# EasyEDA schematic Attiny_sender.json
TITLE: Sheet_1; REV: 1.0; Date: 2026-06-16; Sheet: 1/1; Drawn By: ondori38; Company: Your Company
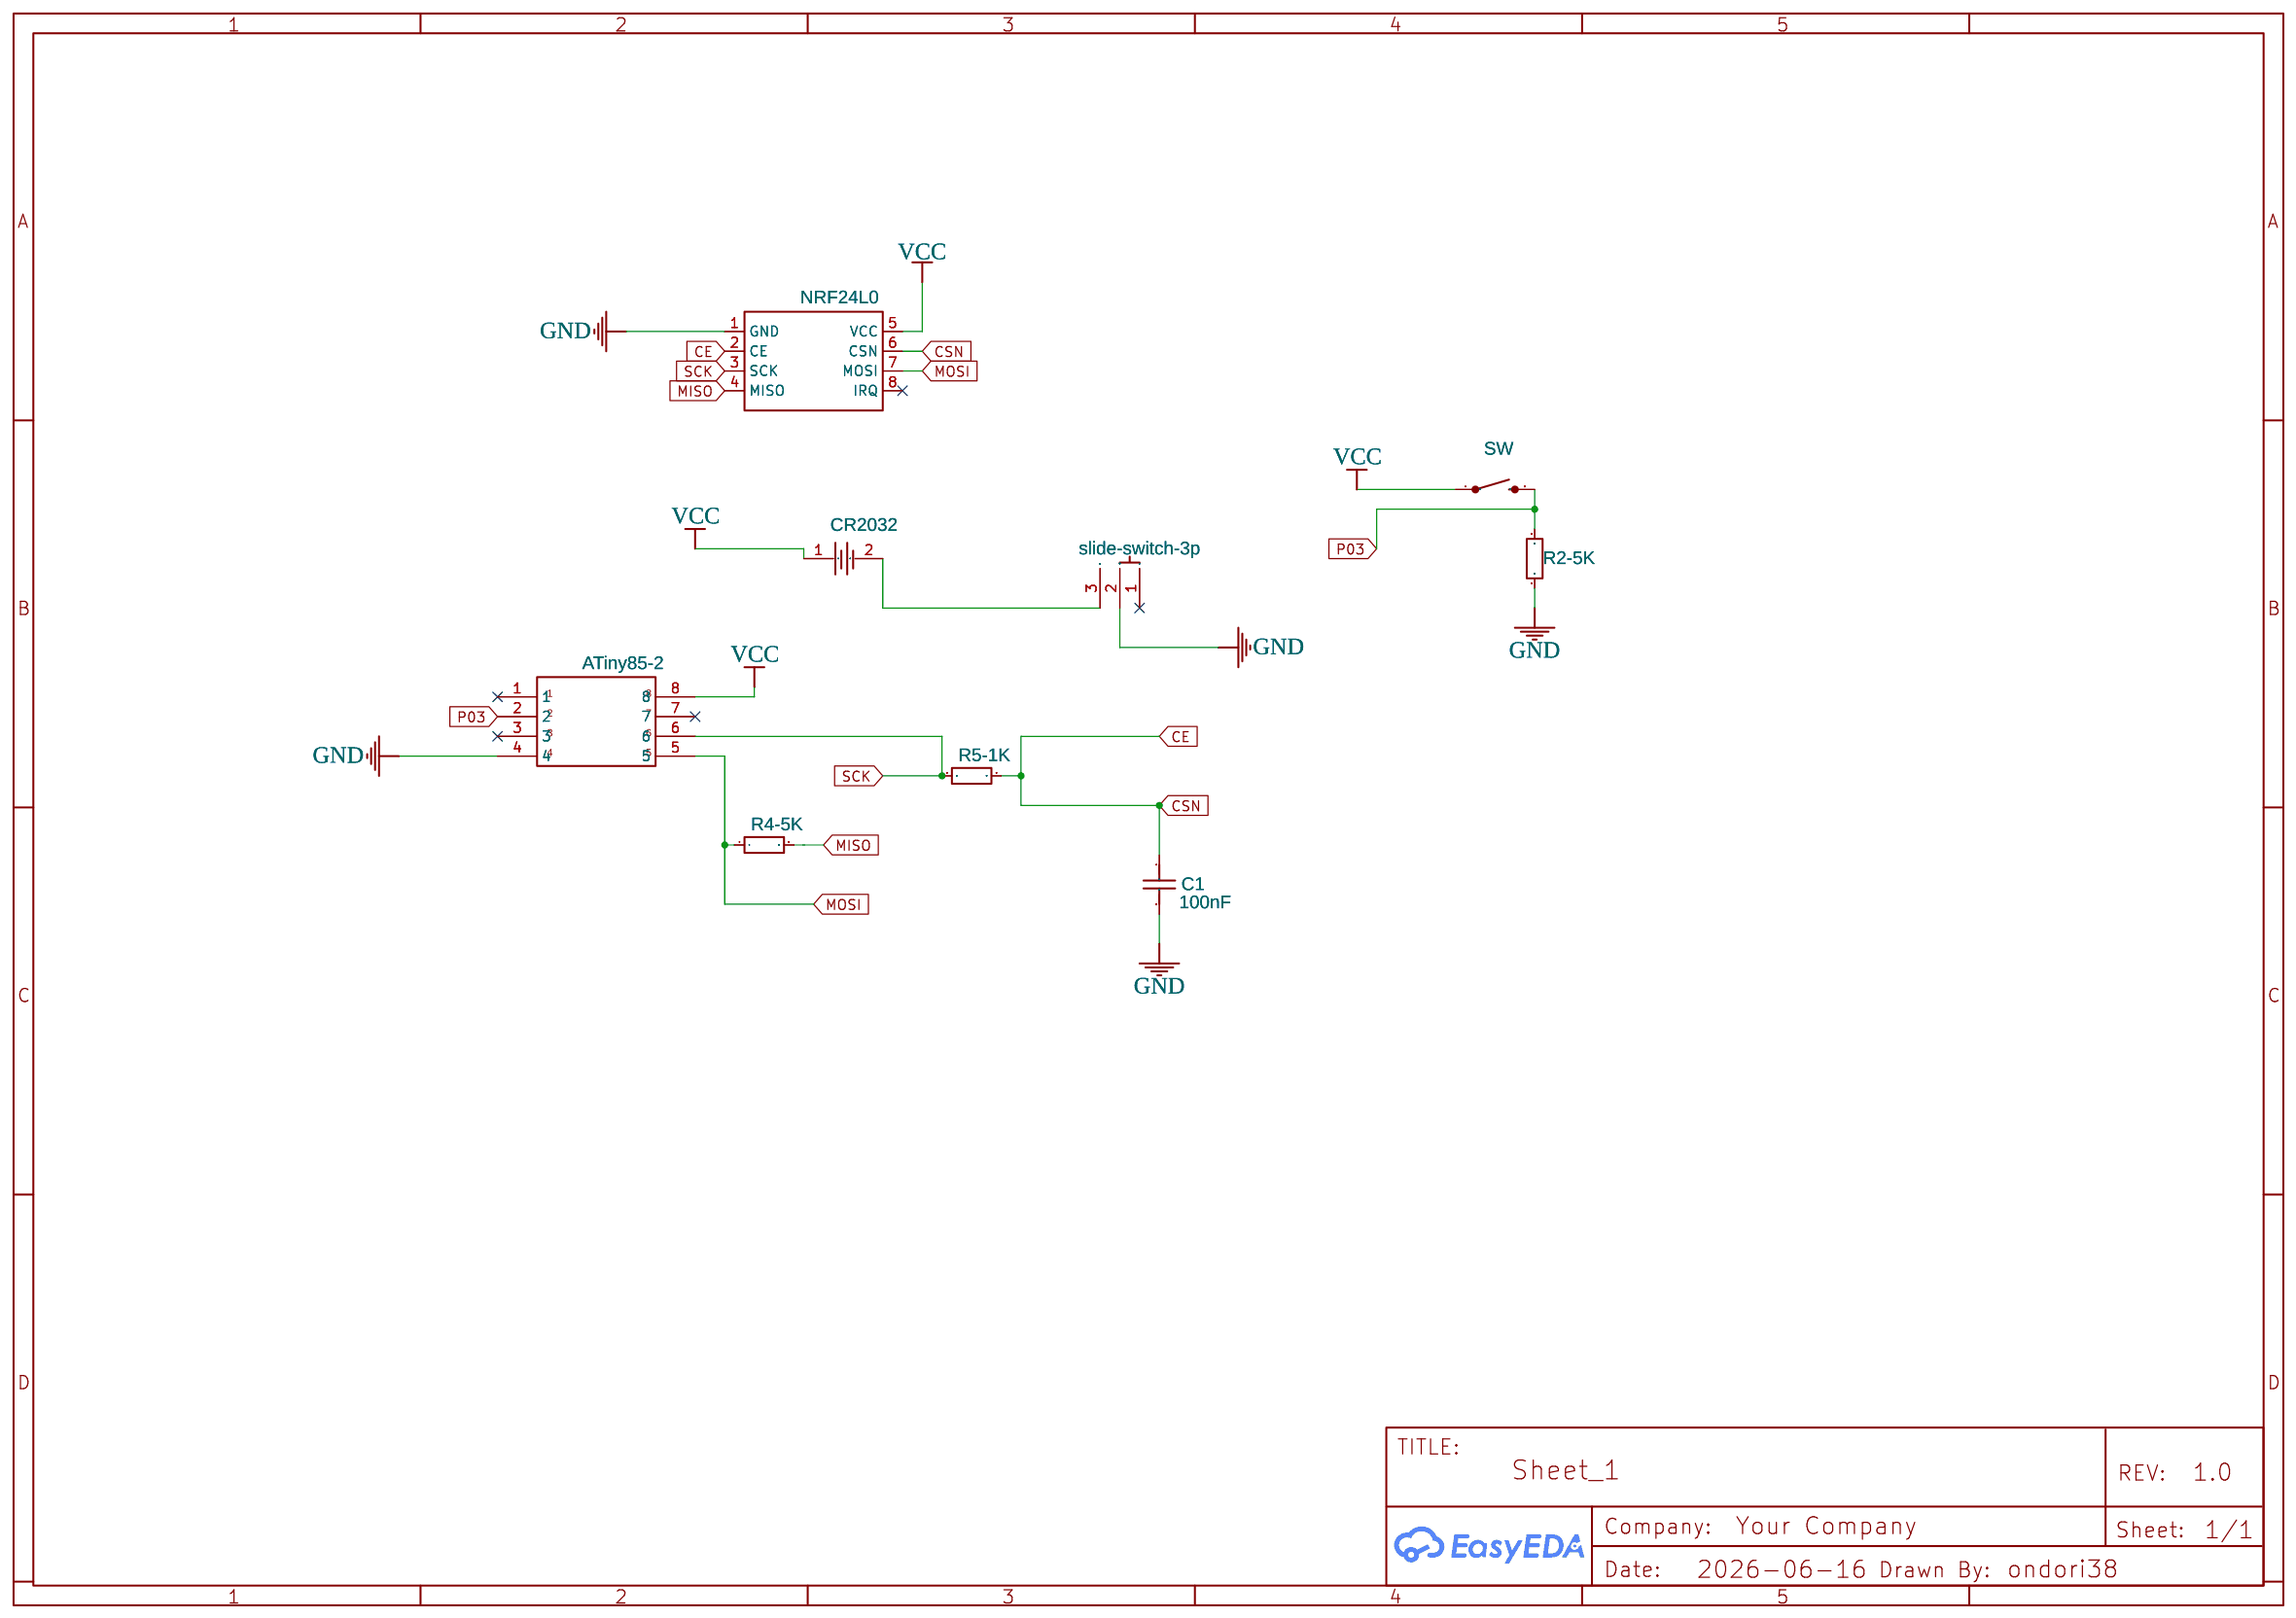
[diagram p0: schematic sheet]

## Parts
A1  NRF24L0  [NRF24L01]
B1  CR2032  [BATT-CR2032]
C1  100nF  [CAPACITOR C1206]
R2  R2-5K  [RESISTOR-SMD-1206]
R4  R4-5K  [RESISTOR-SMD-1206]
R5  R5-1K  [RESISTOR-SMD-1206]
SW  SWITCHES_PTH_EZ  [TACTILE-PTH-EZ]
SW2  slide-switch-3p  [SLIDE-SWITCH-3P-P2.5-3MM-HANDLE-HEIGHT]
U1  ATiny85-2  [ATTINY85]

## Library data of the parts
A1 = NEF24L0: Supplier: AliExpress; Supplier Part: NEF24L0~; Contributor: unitu696
B1 = BATT-CR2032
C1 = Capacitor SMD 1206: Manufacturer Part: Capacitor-1206; Supplier Part: Capacitor-1206; Contributor: Ramsha
R2 R4 R5 = Resistor_THT_12,7mm: Manufacturer Part: C136529; Contributor: motulok08; Package Display: No
SW = SWITCHES_PTH_EZ: Various NO switches- pushbuttons, reed, etc; Contributor: Dman771
SW2 = slide-switch-3p-p3mm-handle-height: Contributor: makerfieber; link: https://tokopedia.link/aYfmxjxZiKb
U1 = ATiny85-2: Contributor: Jesus Choy Ley

## Nets
GND: A1.1(GND) C1.2 R2.1 SW2.2(COM) U1.4
VCC: A1.5(VCC) B1.1 SW.1 U1.8
CE: A1.2(CE) A1.6(CSN) C1.1 R5.2
MISO: A1.4(MISO) R4.2
MOSI: A1.7(MOSI) R4.1 U1.5
P03: R2.2 SW.3(2) U1.2
SCK: A1.3(SCK) R5.1 U1.6
Net-(B1-2): B1.2 SW2.3

Not connected (* = marked no-connect by the designer): A1 8(IRQ)*; SW2 1*; U1 1* 3* 7*
